# EAGLE design fixed GEN-CART-BASIC (EAGLE 9.6.2)
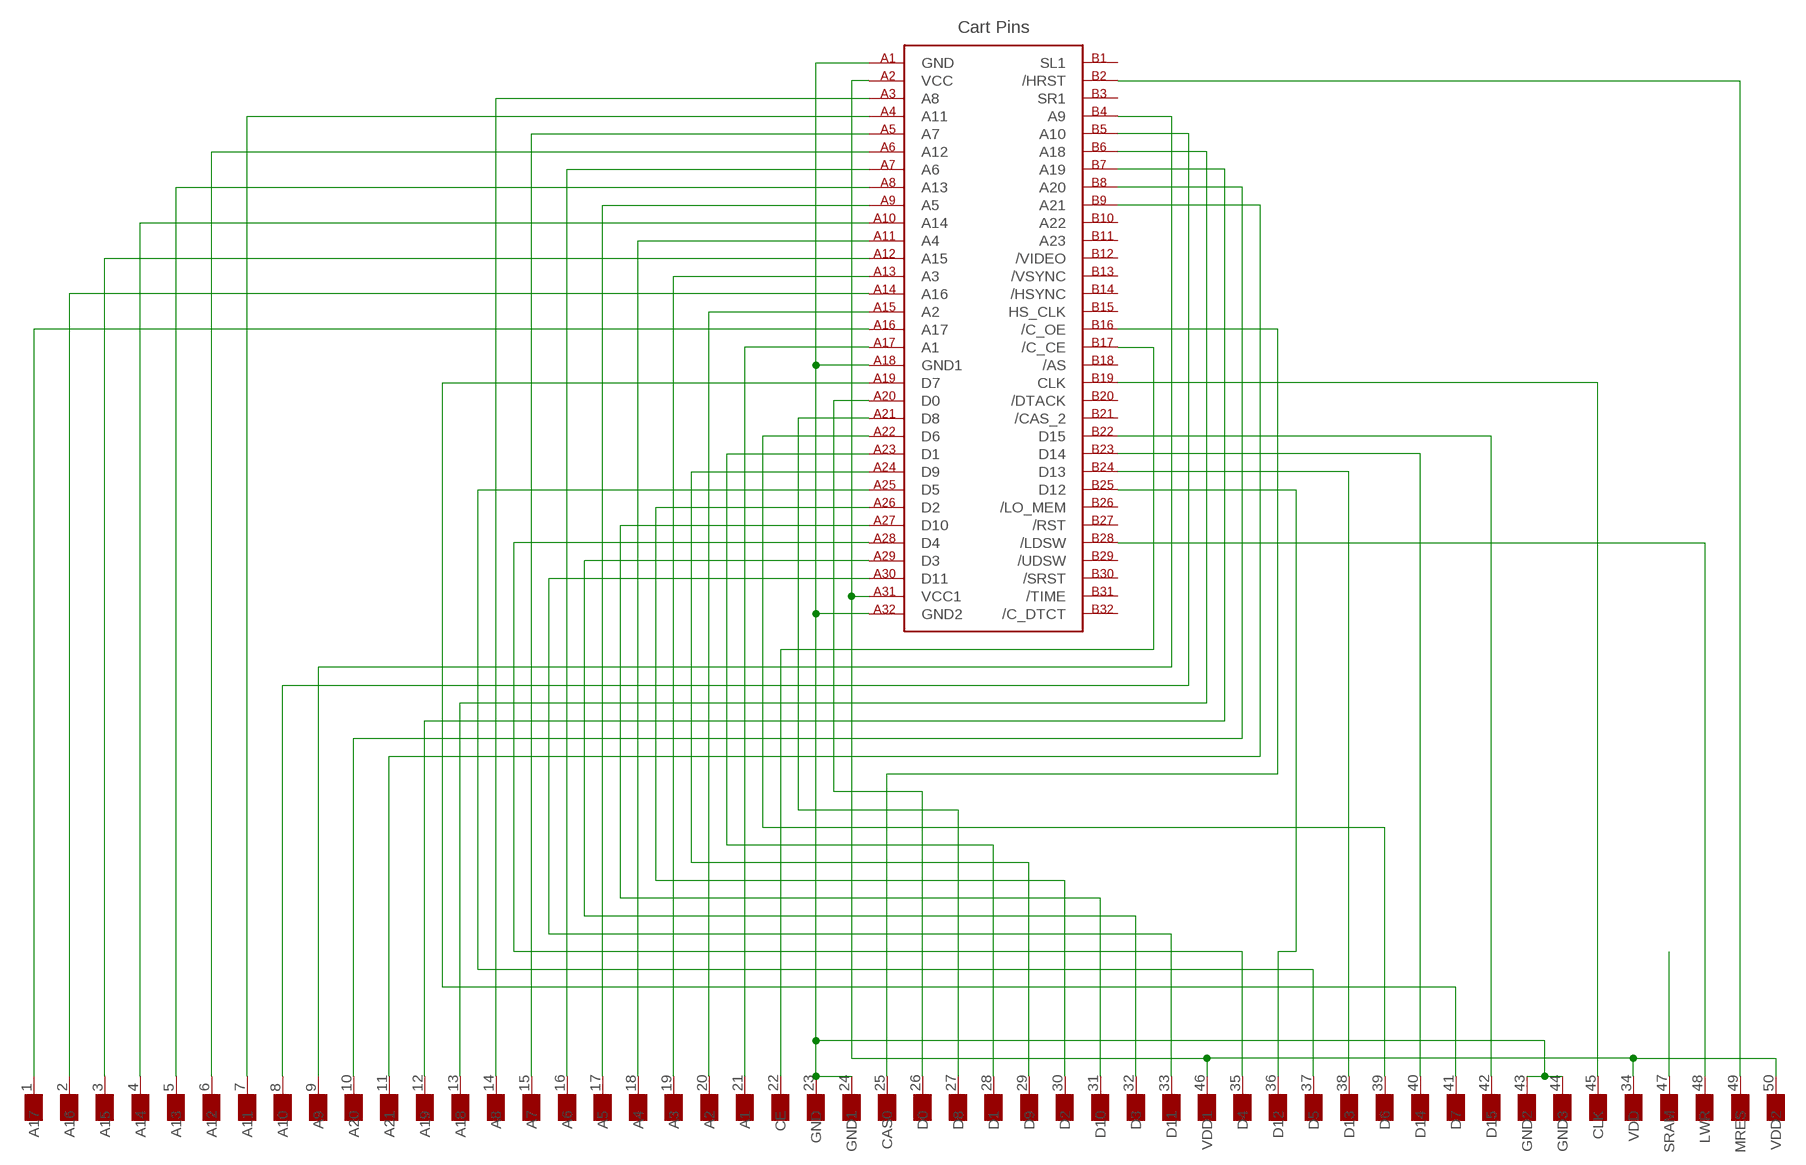
[diagram p0: schematic, sheet 1]

## Parts
P1  GENESIS_CART_EDGE  [GENESIS_CART_EDGE]
U$1  CONNECTOR  [CONNECTOR]

## Nets
N$5: P1.A3(A8) U$1.14(A8)
N$6: P1.A4(A11) U$1.7(A11)
N$7: P1.A5(A7) U$1.15(A7)
N$8: P1.A6(A12) U$1.6(A12)
N$9: P1.A7(A6) U$1.16(A6)
N$10: P1.A8(A13) U$1.5(A13)
N$11: P1.A9(A5) U$1.17(A5)
N$12: P1.A10(A14) U$1.4(A14)
N$13: P1.A11(A4) U$1.18(A4)
N$14: P1.A12(A15) U$1.3(A15)
N$15: P1.A13(A3) U$1.19(A3)
N$16: P1.A14(A16) U$1.2(A16)
N$17: P1.A15(A2) U$1.20(A2)
N$18: P1.A16(A17) U$1.1(A17)
N$19: P1.A17(A1) U$1.21(A1)
N$20: P1.B6(A18) U$1.13(A18)
N$21: P1.B7(A19) U$1.12(A19)
N$22: U$1.47(SRAM)
N$23: P1.A1(GND) P1.A18(GND1) P1.A32(GND2) U$1.23(GND) U$1.24(GND1) U$1.43(GND2) U$1.44(GND3)
N$24: P1.B8(A20) U$1.10(A20)
N$25: P1.B9(A21) U$1.11(A21)
N$26: P1.B17(/C_CE) U$1.22(CE)
N$27: P1.B4(A9) U$1.9(A9)
N$28: P1.B5(A10) U$1.8(A10)
N$29: P1.B16(/C_OE) U$1.25(CAS0)
N$30: P1.A20(D0) U$1.26(D0)
N$31: P1.A21(D8) U$1.27(D8)
N$32: P1.A22(D6) U$1.39(D6)
N$33: P1.B28(/LDSW) U$1.48(LWR)
N$34: P1.A23(D1) U$1.28(D1)
N$35: P1.A24(D9) U$1.29(D9)
N$36: P1.A26(D2) U$1.30(D2)
N$37: P1.A27(D10) U$1.31(D10)
N$38: P1.A29(D3) U$1.32(D3)
N$39: P1.A30(D11) U$1.33(D11)
N$40: P1.A28(D4) U$1.35(D4)
N$41: P1.A25(D5) U$1.37(D5)
N$42: P1.B25(D12) U$1.36(D12)
N$43: P1.B24(D13) U$1.38(D13)
N$44: P1.B23(D14) U$1.40(D14)
N$45: P1.A19(D7) U$1.41(D7)
N$46: P1.B22(D15) U$1.42(D15)
N$47: P1.B19(CLK) U$1.45(CLK)
N$48: P1.B2(/HRST) U$1.49(MRES)
N$49: P1.A2(VCC) P1.A31(VCC1) U$1.34(VDD) U$1.46(VDD1) U$1.50(VDD2)
Unconnected: P1.B1(SL1) P1.B3(SR1) P1.B10(A22) P1.B11(A23) P1.B12(/VIDEO) P1.B13(/VSYNC) P1.B14(/HSYNC) P1.B15(HS_CLK) P1.B18(/AS) P1.B20(/DTACK) P1.B21(/CAS_2) P1.B26(/LO_MEM) P1.B27(/RST) P1.B29(/UDSW) P1.B30(/SRST) P1.B31(/TIME) P1.B32(/C_DTCT)

## Library data of the parts
P1 = gen cart:GENESIS_CART_EDGE
U$1 = pico:CONNECTOR: Connector for sega pico

## Board
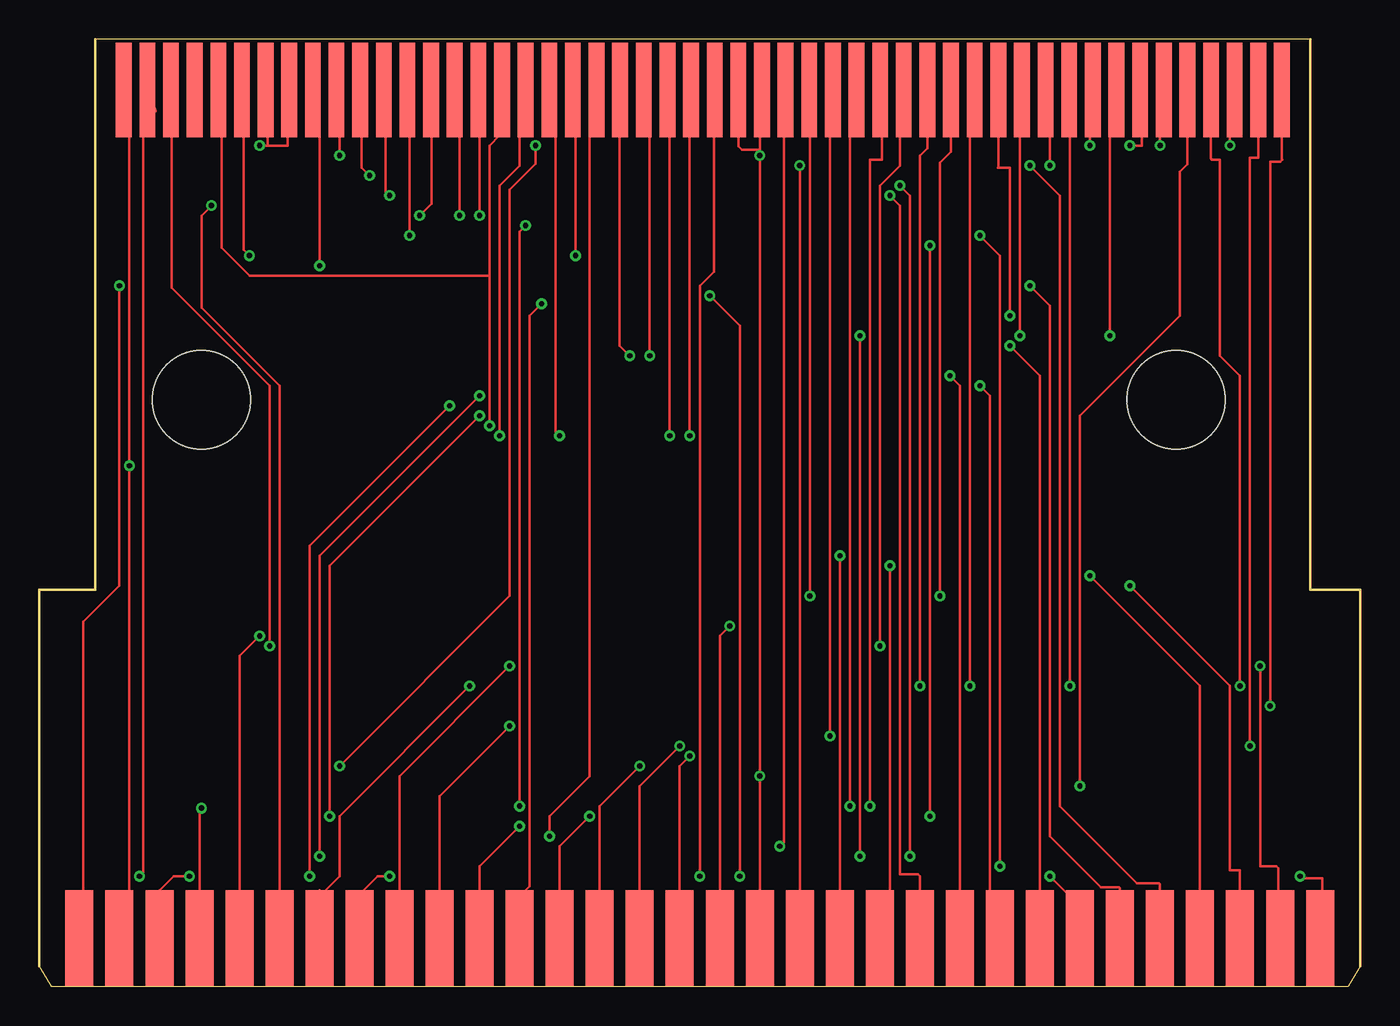
[diagram p1: board, top side]
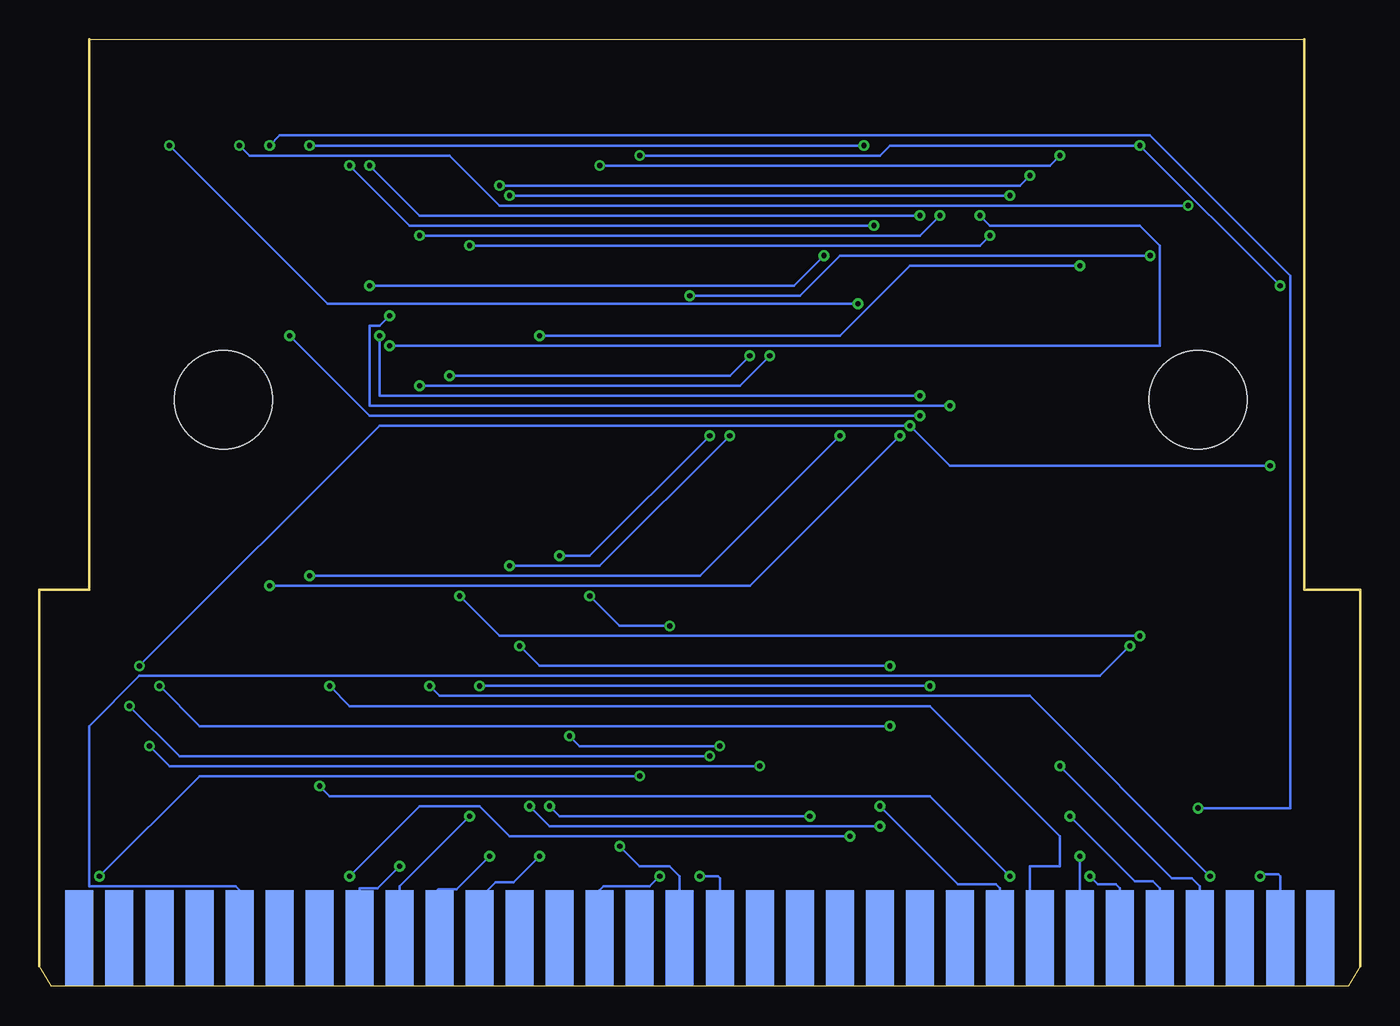
[diagram p2: board, bottom side, seen from below]

Size 83.82 x 60.07 mm. Coordinates in mm from the lower left corner, seen from the top.
Outline: 0.76,0 83.06,0 83.82,1.27 83.82,25.15 80.64,25.15 80.64,60.07 3.56,60.07 3.56,25.15 0,25.15 0,1.27 0.76,0
Copper layers (1*16): Top 0.0356mm / dielectric 1.5011mm / Bottom 0.0356mm
Design rules "LaenPCBOrder": minimum track width 6mil, minimum drill 13mil, track to track 6mil, track to pad 6mil, pad to pad 6mil, via to via 6mil, smd to smd 6mil, copper to edge 15mil, drill to drill 6mil, minimum pad ring 7mil, minimum via ring 7mil, stop-mask expansion 4mil, vias tented up to drill 0mil, thermal gap 10mil
Holes 6.22 mm at 10.29,37.21 72.14,37.21

### Footprints (pad centres in the part's own frame; a part is rotated, then mirrored left to right if it is on the bottom)
GENESIS_CART_EDGE = smd 1.778 x 6.096: A1 -38.1,0; A2 -35.56,0; A3 -33.02,0; A4 -30.48,0; A5 -27.94,0; A6 -25.4,0; A7 -22.86,0; A8 -20.32,0; A9 -17.78,0; A10 -15.24,0; A11 -12.7,0; A12 -10.16,0; A13 -7.62,0; A14 -5.08,0; A15 -2.54,0; A16 0,0; A17 2.54,0; A18 5.08,0; A19 7.62,0; A20 10.16,0; A21 12.7,0; A22 15.24,0; A23 17.78,0; A24 20.32,0; A25 22.86,0; A26 25.4,0; A27 27.94,0; A28 30.48,0; A29 33.02,0; A30 35.56,0; A31 38.1,0; A32 40.64,0 | smd 1.778 x 6.096 bottom: B1 -38.1,0; B2 -35.56,0; B3 -33.02,0; B4 -30.48,0; B5 -27.94,0; B6 -25.4,0; B7 -22.86,0; B8 -20.32,0; B9 -17.78,0; B10 -15.24,0; B11 -12.7,0; B12 -10.16,0; B13 -7.62,0; B14 -5.08,0; B15 -2.54,0; B16 0,0; B17 2.54,0; B18 5.08,0; B19 7.62,0; B20 10.16,0; B21 12.7,0; B22 15.24,0; B23 17.78,0; B24 20.32,0; B25 22.86,0; B26 25.4,0; B27 27.94,0; B28 30.48,0; B29 33.02,0; B30 35.56,0; B31 38.1,0; B32 40.64,0
CONNECTOR = smd 1 x 6: 1 0.9,-3; 2 2.4,-3; 3 3.9,-3; 4 5.4,-3; 5 6.9,-3; 6 8.4,-3; 7 9.9,-3; 8 11.4,-3; 9 12.9,-3; 10 14.4,-3; 11 15.9,-3; 12 17.4,-3; 13 18.9,-3; 14 20.4,-3; 15 21.9,-3; 16 23.4,-3; 17 24.9,-3; 18 26.4,-3; 19 27.9,-3; 20 29.4,-3; 21 30.9,-3; 22 32.4,-3; 23 33.9,-3; 24 35.4,-3; 25 36.9,-3; 26 38.4,-3; 27 39.9,-3; 28 41.4,-3; 29 42.9,-3; 30 44.4,-3; 31 45.9,-3; 32 47.4,-3; 33 48.9,-3; 34 50.4,-3; 35 51.9,-3; 36 53.4,-3; 37 54.9,-3; 38 56.4,-3; 39 57.9,-3; 40 59.4,-3; 41 60.9,-3; 42 62.4,-3; 43 63.9,-3; 44 65.4,-3; 45 66.9,-3; 46 68.4,-3; 47 69.9,-3; 48 71.4,-3; 49 72.9,-3; 50 74.4,-3

### Placement (x,y rotation side)
P1  40.64,3.05 0 top
U$1  79.76,53.85 180 top

### Tracks (layer width: path | path; a pad name or v marks a point on that pad's centre or on a via)
N$5  (via drill 0.33)
  Top 0.152: v59.05,19.05 59.05,56.52 U$1.14 | v9.53,6.99 8.51,6.99 7.62,6.1 P1.A3
  Bottom 0.152: v59.05,19.05 58.42,18.41 20.95,18.41 v9.53,6.99
N$6  (via drill 0.33)
  Top 0.152: 10.21,3.05 P1.A4 10.16,11.18 v10.29,11.3 | 69.85,56.52 U$1.7 69.86,53.97 69.98,53.85 | v69.22,53.34 69.98,53.34 69.98,53.85 | 69.98,53.85 69.98,54.23
  Bottom 0.152: v69.22,53.34 68.58,53.98 13.34,53.98 4.45,45.09 4.45,11.3 v10.29,11.3
N$7  (via drill 0.33)
  Top 0.152: v57.15,24.77 57.15,52.2 57.15,52.25 57.86,52.96 U$1.15 | v13.97,22.23 12.7,20.95 P1.A5
  Bottom 0.152: v57.15,24.77 54.61,22.23 v13.97,22.23
N$8  (via drill 0.33)
  Top 0.152: v71.12,53.34 71.12,56.52 U$1.6 | v10.92,49.53 10.29,48.9 10.29,43.05 15.24,38.1 P1.A6
  Bottom 0.152: v71.12,53.34 70.48,52.7 57.78,52.7 54.61,49.53 v10.92,49.53
N$9  (via drill 0.33)
  Top 0.152: 17.78,5.71 17.78,6.1 | v55.88,19.05 55.88,52.7 56.36,53.18 U$1.16 | v27.3,19.05 19.05,10.79 19.05,6.99 17.78,5.71 | 17.78,5.71 P1.A7
  Bottom 0.152: v27.3,19.05 v55.88,19.05
N$10  (via drill 0.33)
  Top 0.152: 20.42,3.05 P1.A8 20.32,5.84 21.46,6.99 v22.23,6.99 | v66.04,12.7 66.04,36.2 72.39,42.55 72.39,51.69 72.86,52.16 U$1.5
  Bottom 0.152: v66.04,12.7 65.41,12.06 27.3,12.06 v22.23,6.99
N$11  (via drill 0.33)
  Top 0.152: v53.34,21.59 53.34,50.8 54.61,52.07 54.61,56.52 U$1.17 | v29.84,20.32 22.86,13.34 22.86,5.44 22.86,5.08 P1.A9
  Bottom 0.152: v53.34,21.59 52.07,20.32 v29.84,20.32
N$12  (via drill 0.33)
  Top 0.152: 25.3,3.05 P1.A10 25.4,12.06 v29.84,16.51 | v76.2,19.05 76.2,38.73 74.93,40.01 74.93,52.45 74.42,52.45 74.36,52.52 U$1.4
  Bottom 0.152: v76.2,19.05 73.66,16.51 v29.84,16.51
N$13  (via drill 0.33)
  Top 0.152: v52.7,11.43 52.7,52.45 53.47,52.45 53.47,56.74 U$1.18 | v30.48,10.16 27.94,7.62 P1.A11
  Bottom 0.152: v52.7,11.43 51.44,10.16 v30.48,10.16
N$14  (via drill 0.33)
  Top 0.152: v75.56,53.34 75.56,56.52 U$1.3 | v31.88,43.31 31.11,42.55 31.11,6.35 30.48,5.71 P1.A12
  Bottom 0.152: v75.56,53.34 65.53,43.31 v31.88,43.31
N$15  (via drill 0.33)
  Top 0.152: 33.07,3.05 P1.A13 33.02,8.89 v34.92,10.79 | v51.44,11.43 51.44,56.52 U$1.19
  Bottom 0.152: v51.44,11.43 50.8,10.79 v34.92,10.79
N$16  (via drill 0.33)
  Top 0.152: 35.51,5.18 35.51,3.05 P1.A14 35.56,11.43 v38.1,13.97 | v76.83,15.24 76.83,52.58 77.34,52.58 77.36,52.59 U$1.2
  Bottom 0.152: v76.83,15.24 75.56,13.97 v38.1,13.97
N$17  (via drill 0.33)
  Top 0.152: v50.16,15.88 50.16,56.52 U$1.20 | v40.64,15.24 38.1,12.7 P1.A15
  Bottom 0.152: v50.16,15.88 49.53,15.24 v40.64,15.24
N$18  (via drill 0.33)
  Top 0.152: 39.93,3.66 40.54,3.05 P1.A16 40.64,13.97 v41.27,14.61 | v78.11,17.78 78.11,52.32 78.74,52.32 78.87,52.45 78.86,52.46 U$1.1
  Bottom 0.152: v78.11,17.78 74.93,14.61 v41.27,14.61
N$19  (via drill 0.33)
  Top 0.152: 43.13,3.05 P1.A17 43.18,22.23 v43.81,22.86 | v48.9,24.77 48.9,56.52 U$1.21
  Bottom 0.152: v48.9,24.77 46.99,22.86 v43.81,22.86
N$20  (via drill 0.33)
  Top 0.152: v61.59,42.55 61.59,51.94 60.83,51.94 60.86,51.97 U$1.13 | v26.04,36.83 17.14,27.94 v17.14,6.99
  Bottom 0.152: 15.39,3.2 P1.B6 15.24,6.22 15.49,6.48 16.64,6.48 v17.14,6.99 | v61.59,42.55 62.23,41.91 62.87,41.91 62.87,36.83 v26.04,36.83
N$21  (via drill 0.33)
  Top 0.152: v62.23,41.27 62.23,56.52 U$1.12 | v27.94,37.47 17.78,27.3 v17.78,8.26
  Bottom 0.152: 17.07,3.66 17.68,3.05 P1.B7 v17.78,8.26 | v62.23,41.27 62.23,37.47 v27.94,37.47
N$23  (via drill 0.33)
  Top 0.152: 2.59,3.05 P1.A1 2.54,4.83 2.79,5.08 2.79,23.11 5.08,25.4 v5.08,44.45 | 81.23,4.32 81.23,4.83 81.41,5 | 81.23,4.32 81.23,3.05 P1.A32 | 14.53,56.67 U$1.44 14.48,56.73 14.48,53.34 | U$1.43 15.81,56.8 15.76,53.34 14.48,53.34 | 14.48,53.34 v13.97,53.34 | 44.45,57.15 U$1.24 44.36,53.31 44.58,53.09 45.72,53.09 | 45.72,57.15 U$1.23 45.72,56.52 45.72,53.09 | 45.72,53.09 v45.72,52.7 v45.72,13.34 P1.A18 | v80.01,6.99 80.14,6.86 81.41,6.86 81.41,4.5 81.23,4.32
  Bottom 0.152: v5.08,44.45 v13.97,53.34 29.84,53.34 30.48,52.7 v45.72,52.7 | v80.01,6.99 73.66,13.34 v45.72,13.34
N$24  (via drill 0.33)
  Top 0.152: v65.41,19.05 65.41,56.52 U$1.10
  Bottom 0.152: 20.19,5.59 20.32,5.46 20.32,5.08 | v65.41,19.05 64.14,17.78 27.3,17.78 19.05,9.53 19.05,7.62 20.95,7.62 20.95,5.08 20.32,5.08 | 20.32,5.08 P1.B8
N$25  (via drill 0.33)
  Top 0.152: v64.14,52.07 64.14,56.52 U$1.11 | v30.86,48.26 30.48,47.88 v30.48,11.43
  Bottom 0.152: v64.14,52.07 60.33,48.26 v30.86,48.26 | v30.48,11.43 25.53,6.48 23.11,6.48 22.86,6.22 P1.B9
N$26  (via drill 0.33)
  Top 0.152: v46.99,8.89 47.24,9.14 47.24,56.52 47.14,56.63 U$1.22
  Bottom 0.152: 43.13,3.05 P1.B17 43.18,6.99 43.81,7.62 45.72,7.62 v46.99,8.89
N$27  (via drill 0.33)
  Top 0.152: v66.67,53.34 66.67,56.52 U$1.9 | v31.5,53.34 31.5,52.2 29.84,50.55 29.84,24.77 v19.05,13.97
  Bottom 0.152: v31.5,53.34 v66.67,53.34 | P1.B4 10.16,6.35 10.67,6.86 11.94,6.86 v19.05,13.97
N$28  (via drill 0.33)
  Top 0.152: v67.94,41.27 67.94,56.52 U$1.8 | v27.94,36.2 18.41,26.67 v18.41,10.79
  Bottom 0.152: 13.08,5.21 13.11,5.18 12.8,4.88 12.8,3.05 P1.B5 12.7,6.22 13.14,6.67 14.29,6.67 v18.41,10.79 | v67.94,41.27 62.87,36.2 v27.94,36.2
N$29  (via drill 0.33)
  Top 0.152: v41.91,6.99 41.91,44.45 42.8,45.34 42.8,56.79 U$1.25
  Bottom 0.152: 40.54,3.05 P1.B16 40.64,6.86 40.77,6.99 41.78,6.99 41.91,6.86 v41.91,6.99
N$30  (via drill 0.33)
  Top 0.152: 50.9,3.05 P1.A20 v50.8,27.3 | v41.27,34.92 41.27,56.52 U$1.26
  Bottom 0.152: v41.27,34.92 48.9,27.3 v50.8,27.3
N$31  (via drill 0.33)
  Top 0.152: v40.01,34.92 40.01,56.52 U$1.27 | v53.98,26.67 53.98,3.81 53.34,3.17 P1.A21
  Bottom 0.152: v40.01,34.92 48.26,26.67 v53.98,26.67
N$32  (via drill 0.33)
  Top 0.152: 55.65,5.71 55.75,5.71 55.88,5.59 55.88,5.08 P1.A22 55.88,6.99 55.75,7.11 54.61,7.11 54.61,49.53 v53.98,50.16 | v22.23,50.16 21.97,50.42 21.97,56.74 U$1.39
  Bottom 0.152: v53.98,50.16 v22.23,50.16
N$33  (via drill 0.33)
  Top 0.152: v14.61,21.59 14.61,38.1 8.38,44.32 8.38,56.39 8.26,56.52 U$1.48
  Bottom 0.152: v14.61,21.59 16.51,19.68 77.47,19.68 80.64,16.51 80.64,6.35 71.37,6.35 71.02,5.99 71.02,3.05 P1.B28 71.12,5.08
N$34  (via drill 0.33)
  Top 0.152: 58.19,5.97 58.29,5.97 58.29,3.43 58.14,3.28 58.37,3.05 P1.A23 58.42,38.1 v57.78,38.73 | v38.73,40.01 38.73,56.52 U$1.28
  Bottom 0.152: v38.73,40.01 40.01,38.73 v57.78,38.73
N$35  (via drill 0.33)
  Top 0.152: 60.96,4.45 60.96,4.88 60.8,5.04 60.83,5.08 60.83,5.97 | v37.47,40.01 36.83,40.64 36.83,56.52 U$1.29 | v59.69,38.1 60.33,37.47 60.33,5.08 60.96,4.45 | 60.96,4.45 P1.A24
  Bottom 0.152: v37.47,40.01 39.37,38.1 v59.69,38.1
N$36  (via drill 0.33)
  Top 0.152: 65.99,3.05 P1.A26 66.04,5.08 v64.14,6.99 | v32.38,9.53 32.38,10.79 34.92,13.34 34.92,56.52 U$1.30
  Bottom 0.152: v32.38,9.53 53.98,9.53 55.88,11.43 59.69,11.43 v64.14,6.99
N$37  (via drill 0.33)
  Top 0.152: v34.04,46.35 34.04,56.71 U$1.31 | v62.87,44.45 64.14,43.18 64.14,9.53 67.37,6.29 68.52,6.29 68.58,6.22 68.58,5.59 68.33,5.33 68.58,5.08 P1.A27
  Bottom 0.152: v34.04,46.35 35.94,44.45 v62.87,44.45
N$38  (via drill 0.33)
  Top 0.152: 73.61,3.05 P1.A29 73.66,19.05 v66.67,26.04 | v33.02,34.92 32.77,35.18 32.77,56.13 32.38,56.52 U$1.32
  Bottom 0.152: v33.02,34.92 41.91,26.04 v66.67,26.04
N$39  (via drill 0.33)
  Top 0.152: v29.21,34.92 29.21,50.8 30.48,52.07 30.48,56.52 U$1.33 | v69.22,25.4 75.56,19.05 75.56,7.37 76.2,7.37 P1.A30
  Bottom 0.152: v29.21,34.92 38.73,25.4 v69.22,25.4
N$40  (via drill 0.33)
  Top 0.152: 71.02,3.05 P1.A28 71.12,5.08 70.99,5.21 71.12,5.33 71.12,6.48 71.06,6.54 69.66,6.54 64.77,11.43 64.77,50.16 v62.87,52.07 | v27.94,48.9 27.94,56.52 U$1.35
  Bottom 0.152: v27.94,48.9 59.69,48.9 v62.87,52.07
N$41  (via drill 0.33)
  Top 0.152: 63.55,3.05 P1.A25 63.5,38.73 v61.59,40.64 | v24.13,48.9 24.89,49.66 24.89,56.81 U$1.37
  Bottom 0.152: v24.13,48.9 23.5,48.26 13.97,48.26 12.7,46.99 12.7,40.64 v61.59,40.64
N$42  (via drill 0.33)
  Top 0.152: v26.67,48.9 26.67,56.52 U$1.36 | v59.69,47.62 60.96,46.35 v60.96,7.62
  Bottom 0.152: 63.4,4.88 63.4,3.05 P1.B25 63.5,5.08 63.37,5.21 63.5,5.33 63.5,6.22 62.36,6.22 v60.96,7.62 | v26.67,48.9 27.94,47.62 v59.69,47.62
N$43  (via drill 0.33)
  Top 0.152: v23.5,47.62 23.5,56.52 U$1.38 | v56.52,10.79 v56.52,46.99
  Bottom 0.152: v23.5,47.62 24.13,46.99 v56.52,46.99 | v56.52,10.79 60.96,6.35 60.96,4.88 60.96,4.45 P1.B24
N$44  (via drill 0.33)
  Top 0.152: v20.95,51.44 20.45,51.94 20.45,56.39 20.32,56.52 U$1.40 | v54.61,50.8 55.24,50.16 v55.24,8.26
  Bottom 0.152: 58.37,4.88 58.37,3.05 P1.B23 58.42,4.95 58.55,5.08 58.55,6.1 58.48,6.16 57.34,6.16 v55.24,8.26 | v20.95,51.44 21.59,50.8 v54.61,50.8
N$45  (via drill 0.33)
  Top 0.152: 48.51,5.08 48.31,4.88 48.31,3.05 P1.A19 v48.26,52.07 | v19.05,52.7 19.05,56.52 U$1.41
  Bottom 0.152: v19.05,52.7 19.68,52.07 v48.26,52.07
N$46  (via drill 0.33)
  Top 0.152: v17.78,45.72 17.78,56.52 U$1.42 | v52.07,8.26 v52.07,41.27
  Bottom 0.152: 55.88,5.08 55.73,4.93 55.78,4.88 55.78,3.05 P1.B22 55.88,5.08 | v17.78,45.72 28.57,45.72 33.02,41.27 v52.07,41.27 | v52.07,8.26 53.72,6.6 54.86,6.6 55.88,5.59 55.88,5.08
N$47  (via drill 0.33)
  Top 0.152: v13.34,46.35 12.95,46.74 12.95,56.78 U$1.45 | v42.55,43.81 44.45,41.91 v44.45,6.99
  Bottom 0.152: v13.34,46.35 33.02,46.35 35.56,43.81 v42.55,43.81 | v44.45,6.99 45.09,6.35 48.01,6.35 48.26,6.1 P1.B19
N$48  (via drill 0.33)
  Top 0.152: v6.35,6.99 6.6,7.24 6.6,54.74 7.38,55.51 U$1.49
  Bottom 0.152: v6.35,6.99 6.35,6.86 6.1,7.11 5.59,7.11 5.21,7.11 5.08,6.99 P1.B2
N$49  (via drill 0.33)
  Top 0.152: 78.64,3.05 P1.A31 78.61,3.17 78.61,7.49 78.49,7.62 77.47,7.62 v77.47,20.32 | U$1.50 5.71,56.52 v5.71,33.02 5.71,3.81 5.08,3.17 P1.A2 | 28.57,45.09 13.34,45.09 11.56,46.86 11.56,55.94 U$1.46 | 28.57,45.09 28.57,53.34 29.21,53.98 29.21,56.52 U$1.34 | 28.57,45.09 v28.57,35.56
  Bottom 0.152: v77.47,20.32 62.23,35.56 v28.57,35.56 26.04,33.02 v5.71,33.02